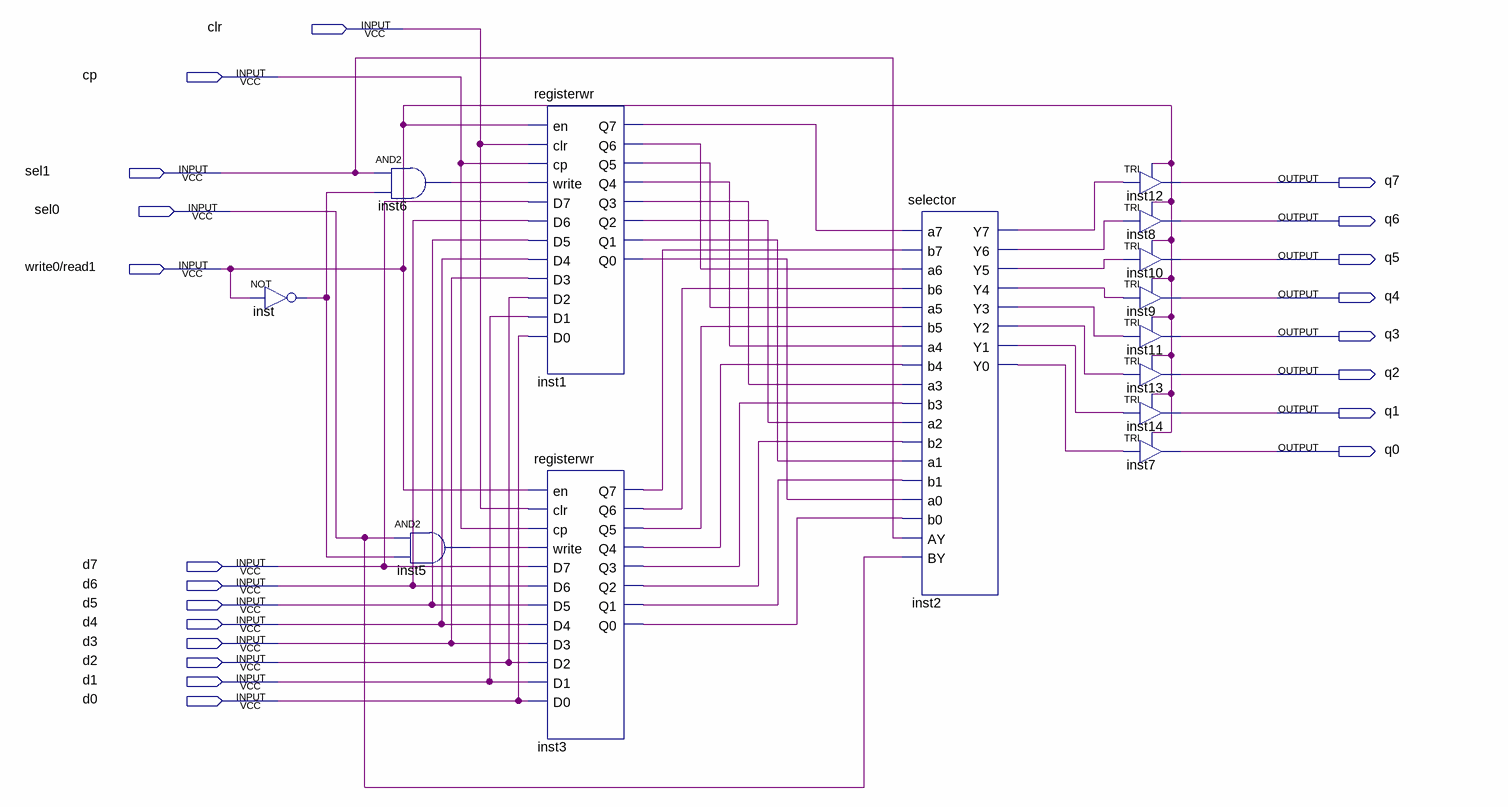
[diagram p0: schematic sheet]
// Quartus schematic registers.bdf as structural Verilog: 14 symbols, 21 pins
module registers (
  input  clr,
  input  cp,
  input  sel1,
  input  sel0,
  input  \write0/read1 ,
  input  d7,
  input  d6,
  input  d5,
  input  d4,
  input  d3,
  input  d2,
  input  d1,
  input  d0,
  output q7,
  output q6,
  output q5,
  output q4,
  output q3,
  output q2,
  output q1,
  output q0
);

  wire inst1_q0, inst1_q1, inst1_q2, inst1_q3, inst1_q4, inst1_q5, inst1_q6, inst1_q7, inst2_y0, inst2_y1,
       inst2_y2, inst2_y3, inst2_y4, inst2_y5, inst2_y6, inst2_y7, inst3_q0, inst3_q1, inst3_q2, inst3_q3,
       inst3_q4, inst3_q5, inst3_q6, inst3_q7, inst5_out, inst6_out, inst_out;

  not inst (inst_out, \write0/read1 );
  and inst6 (inst6_out, sel1, inst_out);
  and inst5 (inst5_out, sel0, inst_out);
  registerwr inst1 (
    .en(\write0/read1 ), .clr(clr), .cp(cp), .write(inst6_out), .D7(d7), .D6(d6), .D5(d5), .D4(d4), .D3(d3),
    .D2(d2), .D1(d1), .D0(d0), .Q7(inst1_q7), .Q6(inst1_q6), .Q5(inst1_q5), .Q4(inst1_q4), .Q3(inst1_q3),
    .Q2(inst1_q2), .Q1(inst1_q1), .Q0(inst1_q0));
  registerwr inst3 (
    .en(\write0/read1 ), .clr(clr), .cp(cp), .write(inst5_out), .D7(d7), .D6(d6), .D5(d5), .D4(d4), .D3(d3),
    .D2(d2), .D1(d1), .D0(d0), .Q7(inst3_q7), .Q6(inst3_q6), .Q5(inst3_q5), .Q4(inst3_q4), .Q3(inst3_q3),
    .Q2(inst3_q2), .Q1(inst3_q1), .Q0(inst3_q0));
  selector inst2 (
    .a7(inst1_q7), .b7(inst3_q7), .a6(inst1_q6), .b6(inst3_q6), .a5(inst1_q5), .b5(inst3_q5), .a4(inst1_q4),
    .b4(inst3_q4), .a3(inst1_q3), .b3(inst3_q3), .a2(inst1_q2), .b2(inst3_q2), .a1(inst1_q1), .b1(inst3_q1),
    .a0(inst1_q0), .b0(inst3_q0), .AY(sel1), .BY(sel0), .Y7(inst2_y7), .Y6(inst2_y6), .Y5(inst2_y5),
    .Y4(inst2_y4), .Y3(inst2_y3), .Y2(inst2_y2), .Y1(inst2_y1), .Y0(inst2_y0));
  TRI inst12 (.IN(inst2_y7), .OE(\write0/read1 ), .OUT(q7));
  TRI inst8 (.IN(inst2_y6), .OE(\write0/read1 ), .OUT(q6));
  TRI inst10 (.IN(inst2_y5), .OE(\write0/read1 ), .OUT(q5));
  TRI inst9 (.IN(inst2_y4), .OE(\write0/read1 ), .OUT(q4));
  TRI inst11 (.IN(inst2_y3), .OE(\write0/read1 ), .OUT(q3));
  TRI inst13 (.IN(inst2_y2), .OE(\write0/read1 ), .OUT(q2));
  TRI inst14 (.IN(inst2_y1), .OE(\write0/read1 ), .OUT(q1));
  TRI inst7 (.IN(inst2_y0), .OE(\write0/read1 ), .OUT(q0));
endmodule
